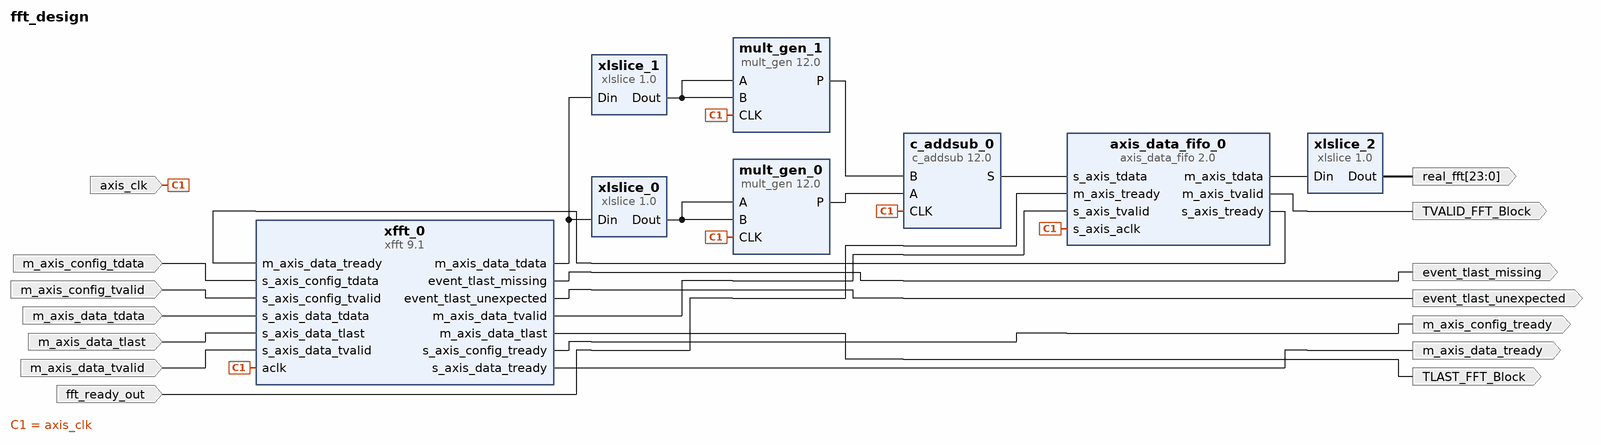
[diagram p0: block diagram of the top level]
# Vivado block design fft_design, xc7a35tcpg236-1, Vivado 2024.2
create_bd_design fft_design

create_bd_port -dir O TVALID_FFT_Block
create_bd_port -dir O TLAST_FFT_Block
create_bd_port -dir I -type data m_axis_data_tdata
create_bd_port -dir I -type data m_axis_data_tvalid
create_bd_port -dir I -type data m_axis_data_tlast
create_bd_port -dir I -type clk axis_clk
set_property -dict {CONFIG.FREQ_HZ 44000000} [get_bd_ports axis_clk]
create_bd_port -dir I -type data m_axis_config_tdata
create_bd_port -dir I -type data m_axis_config_tvalid
create_bd_port -dir O -type data m_axis_config_tready
create_bd_port -dir I fft_ready_out
create_bd_port -dir O m_axis_data_tready
create_bd_port -dir O event_tlast_unexpected
create_bd_port -dir O event_tlast_missing
create_bd_port -dir O -from 23 -to 0 -type data real_fft

create_bd_cell -type ip -vlnv xilinx.com:ip:xfft:9.1 xfft_0
set_property -dict [list \
  CONFIG.implementation_options automatically_select \
  CONFIG.input_width 24 \
  CONFIG.number_of_stages_using_block_ram_for_data_and_phase_factors 3 \
  CONFIG.output_ordering natural_order \
  CONFIG.phase_factor_width 24 \
  CONFIG.target_clock_frequency 22 \
  CONFIG.target_data_throughput 22 \
  CONFIG.transform_length 1024 \
] [get_bd_cells xfft_0]
create_bd_cell -type ip -vlnv xilinx.com:ip:xlslice:1.0 xlslice_2
set_property -dict {CONFIG.DIN_FROM 23 CONFIG.DIN_WIDTH 48} [get_bd_cells xlslice_2]
create_bd_cell -type ip -vlnv xilinx.com:ip:c_addsub:12.0 c_addsub_0
set_property -dict [list \
  CONFIG.A_Width 48 \
  CONFIG.B_Value 000000000000000000000000000000000000000000000000 \
  CONFIG.B_Width 48 \
  CONFIG.CE false \
  CONFIG.Latency 1 \
  CONFIG.Out_Width 48 \
] [get_bd_cells c_addsub_0]
create_bd_cell -type ip -vlnv xilinx.com:ip:xlslice:1.0 xlslice_0
set_property -dict {CONFIG.DIN_FROM 47 CONFIG.DIN_TO 24 CONFIG.DIN_WIDTH 48 CONFIG.DOUT_WIDTH 24} [get_bd_cells xlslice_0]
create_bd_cell -type ip -vlnv xilinx.com:ip:xlslice:1.0 xlslice_1
set_property -dict {CONFIG.DIN_FROM 23 CONFIG.DIN_TO 0 CONFIG.DIN_WIDTH 48 CONFIG.DOUT_WIDTH 24} [get_bd_cells xlslice_1]
create_bd_cell -type ip -vlnv xilinx.com:ip:mult_gen:12.0 mult_gen_0
set_property -dict {CONFIG.PortAWidth 24 CONFIG.PortBWidth 24} [get_bd_cells mult_gen_0]
create_bd_cell -type ip -vlnv xilinx.com:ip:mult_gen:12.0 mult_gen_1
set_property -dict {CONFIG.PortAWidth 24 CONFIG.PortBWidth 24} [get_bd_cells mult_gen_1]
create_bd_cell -type ip -vlnv xilinx.com:ip:axis_data_fifo:2.0 axis_data_fifo_0
set_property -dict {CONFIG.FIFO_DEPTH 1024 CONFIG.FIFO_MEMORY_TYPE block CONFIG.TDATA_NUM_BYTES 6} [get_bd_cells axis_data_fifo_0]

# ---- connections ----

connect_bd_net [get_bd_pins axis_data_fifo_0/m_axis_tdata] [get_bd_pins xlslice_2/Din]
connect_bd_net [get_bd_pins axis_data_fifo_0/m_axis_tvalid] [get_bd_ports TVALID_FFT_Block]
connect_bd_net [get_bd_pins axis_data_fifo_0/s_axis_tready] [get_bd_pins xfft_0/m_axis_data_tready]
connect_bd_net [get_bd_pins c_addsub_0/S] [get_bd_pins axis_data_fifo_0/s_axis_tdata]
connect_bd_net -net cfg_1 [get_bd_ports m_axis_config_tdata] [get_bd_pins xfft_0/s_axis_config_tdata]
connect_bd_net -net clk_wiz_0_clk_out1 [get_bd_ports axis_clk] \
  [get_bd_pins xfft_0/aclk] [get_bd_pins c_addsub_0/CLK] [get_bd_pins mult_gen_0/CLK] [get_bd_pins mult_gen_1/CLK] \
  [get_bd_pins axis_data_fifo_0/s_axis_aclk]
connect_bd_net [get_bd_ports fft_ready_out] [get_bd_pins axis_data_fifo_0/m_axis_tready]
connect_bd_net [get_bd_ports m_axis_config_tvalid] [get_bd_pins xfft_0/s_axis_config_tvalid]
connect_bd_net -net m_axis_data_1 [get_bd_ports m_axis_data_tdata] [get_bd_pins xfft_0/s_axis_data_tdata]
connect_bd_net -net m_axis_last_1 [get_bd_ports m_axis_data_tlast] [get_bd_pins xfft_0/s_axis_data_tlast]
connect_bd_net -net m_axis_valid_1 [get_bd_ports m_axis_data_tvalid] [get_bd_pins xfft_0/s_axis_data_tvalid]
connect_bd_net [get_bd_pins mult_gen_0/P] [get_bd_pins c_addsub_0/A]
connect_bd_net [get_bd_pins mult_gen_1/P] [get_bd_pins c_addsub_0/B]
connect_bd_net [get_bd_pins xfft_0/event_tlast_missing] [get_bd_ports event_tlast_missing]
connect_bd_net [get_bd_pins xfft_0/event_tlast_unexpected] [get_bd_ports event_tlast_unexpected]
connect_bd_net [get_bd_pins xfft_0/m_axis_data_tdata] [get_bd_pins xlslice_1/Din] [get_bd_pins xlslice_0/Din]
connect_bd_net [get_bd_pins xfft_0/m_axis_data_tlast] [get_bd_ports TLAST_FFT_Block]
connect_bd_net [get_bd_pins xfft_0/m_axis_data_tvalid] [get_bd_pins axis_data_fifo_0/s_axis_tvalid]
connect_bd_net [get_bd_pins xfft_0/s_axis_config_tready] [get_bd_ports m_axis_config_tready]
connect_bd_net [get_bd_pins xfft_0/s_axis_data_tready] [get_bd_ports m_axis_data_tready]
connect_bd_net [get_bd_pins xlslice_0/Dout] [get_bd_pins mult_gen_0/A] [get_bd_pins mult_gen_0/B]
connect_bd_net [get_bd_pins xlslice_1/Dout] [get_bd_pins mult_gen_1/A] [get_bd_pins mult_gen_1/B]
connect_bd_net [get_bd_pins xlslice_2/Dout] [get_bd_ports real_fft]

validate_bd_design
save_bd_design
